# EAGLE design EMMITER (EAGLE 7.5.0)
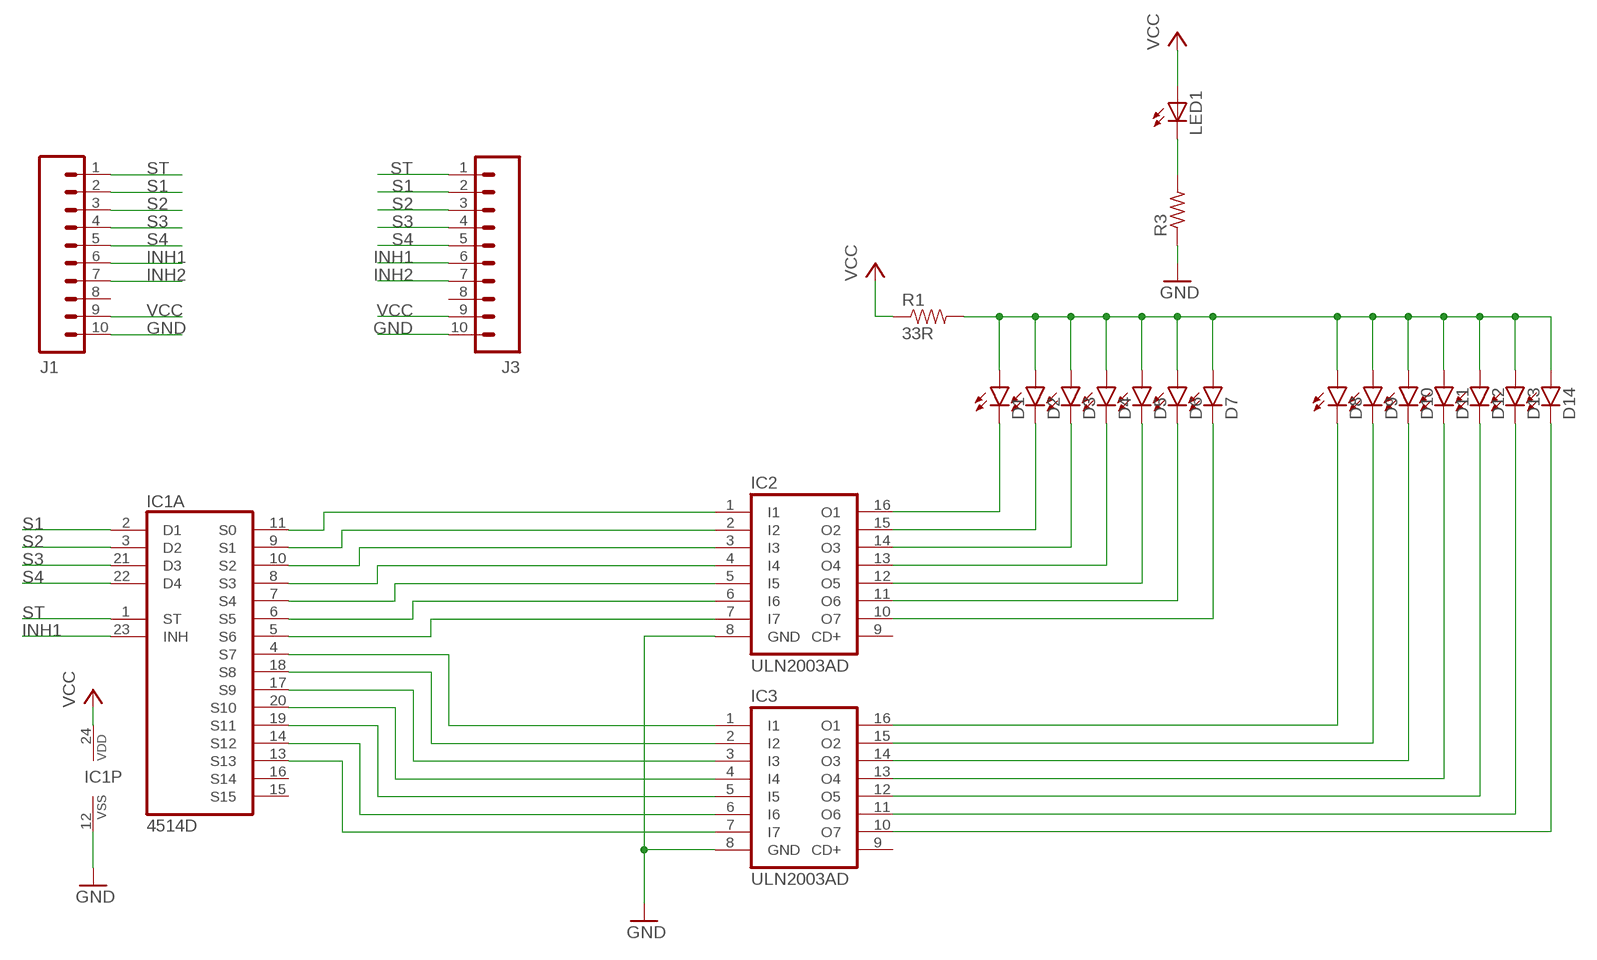
[diagram p0: schematic, sheet 1, part 1 of 2]
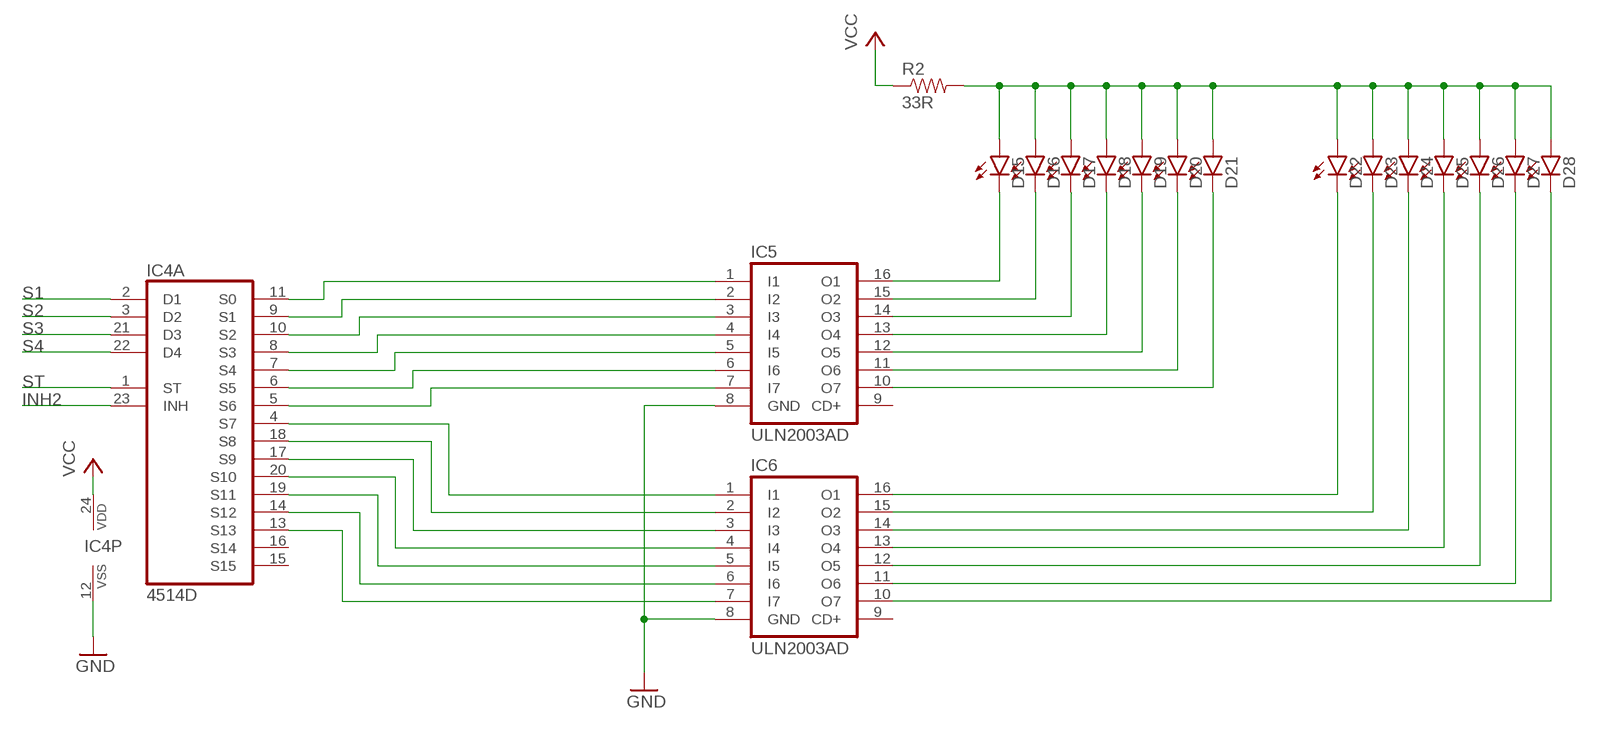
[diagram p1: schematic, sheet 1, part 2 of 2]

## Parts
D1  LED5MM  [LED5MM]
D2  LED5MM  [LED5MM]
D3  LED5MM  [LED5MM]
D4  LED5MM  [LED5MM]
D5  LED5MM  [LED5MM]
D6  LED5MM  [LED5MM]
D7  LED5MM  [LED5MM]
D8  LED5MM  [LED5MM]
D9  LED5MM  [LED5MM]
D10  LED5MM  [LED5MM]
D11  LED5MM  [LED5MM]
D12  LED5MM  [LED5MM]
D13  LED5MM  [LED5MM]
D14  LED5MM  [LED5MM]
D15  LED5MM  [LED5MM]
D16  LED5MM  [LED5MM]
D17  LED5MM  [LED5MM]
D18  LED5MM  [LED5MM]
D19  LED5MM  [LED5MM]
D20  LED5MM  [LED5MM]
D21  LED5MM  [LED5MM]
D22  LED5MM  [LED5MM]
D23  LED5MM  [LED5MM]
D24  LED5MM  [LED5MM]
D25  LED5MM  [LED5MM]
D26  LED5MM  [LED5MM]
D27  LED5MM  [LED5MM]
D28  LED5MM  [LED5MM]
IC1  4514D  [SO24W]
IC2  ULN2003AD  [SO16]
IC3  ULN2003AD  [SO16]
IC4  4514D  [SO24W]
IC5  ULN2003AD  [SO16]
IC6  ULN2003AD  [SO16]
J1  M10LOCK  [1X10_LOCK]
J3  M10LOCK  [1X10_LOCK]
LED1  LEDSMT1206  [1206]
R1  33R  RESISTORPTH-2W  [AXIAL-0.8]
R2  33R  RESISTORPTH-2W  [AXIAL-0.8]
R3  R-US_M1206  [M1206]

## Nets
GND: IC1.12(P:VSS) IC2.8(GND) IC3.8(GND) IC4.12(P:VSS) IC5.8(GND) IC6.8(GND) J1.10 J3.10 R3.1
INH1: IC1.23(A:INH) J1.6 J3.6
INH2: IC4.23(A:INH) J1.7 J3.7
N$1: IC1.11(A:S0) IC2.1(I1)
N$2: IC1.9(A:S1) IC2.2(I2)
N$3: IC1.10(A:S2) IC2.3(I3)
N$4: IC1.8(A:S3) IC2.4(I4)
N$5: IC1.7(A:S4) IC2.5(I5)
N$6: IC1.6(A:S5) IC2.6(I6)
N$7: IC1.5(A:S6) IC2.7(I7)
N$8: IC1.4(A:S7) IC3.1(I1)
N$9: IC1.18(A:S8) IC3.2(I2)
N$10: IC1.17(A:S9) IC3.3(I3)
N$11: IC1.20(A:S10) IC3.4(I4)
N$12: IC1.19(A:S11) IC3.5(I5)
N$13: IC1.14(A:S12) IC3.6(I6)
N$14: IC1.13(A:S13) IC3.7(I7)
N$15: D1.K(C) IC2.16(O1)
N$16: D2.K(C) IC2.15(O2)
N$17: D3.K(C) IC2.14(O3)
N$18: D4.K(C) IC2.13(O4)
N$19: D5.K(C) IC2.12(O5)
N$20: D6.K(C) IC2.11(O6)
N$21: D7.K(C) IC2.10(O7)
N$22: D8.K(C) IC3.16(O1)
N$23: D9.K(C) IC3.15(O2)
N$24: D10.K(C) IC3.14(O3)
N$25: D11.K(C) IC3.13(O4)
N$26: D12.K(C) IC3.12(O5)
N$27: D13.K(C) IC3.11(O6)
N$28: D14.K(C) IC3.10(O7)
N$29: IC4.11(A:S0) IC5.1(I1)
N$30: D1.A D2.A D3.A D4.A D5.A D6.A D7.A D8.A D9.A D10.A D11.A D12.A D13.A D14.A R1.P$2
N$31: IC4.9(A:S1) IC5.2(I2)
N$32: IC4.10(A:S2) IC5.3(I3)
N$33: IC4.8(A:S3) IC5.4(I4)
N$34: IC4.7(A:S4) IC5.5(I5)
N$35: IC4.6(A:S5) IC5.6(I6)
N$36: IC4.5(A:S6) IC5.7(I7)
N$37: IC4.4(A:S7) IC6.1(I1)
N$38: IC4.18(A:S8) IC6.2(I2)
N$39: IC4.17(A:S9) IC6.3(I3)
N$40: IC4.20(A:S10) IC6.4(I4)
N$41: IC4.19(A:S11) IC6.5(I5)
N$42: IC4.14(A:S12) IC6.6(I6)
N$43: IC4.13(A:S13) IC6.7(I7)
N$44: D15.K(C) IC5.16(O1)
N$45: D16.K(C) IC5.15(O2)
N$46: D17.K(C) IC5.14(O3)
N$47: D18.K(C) IC5.13(O4)
N$48: D19.K(C) IC5.12(O5)
N$49: D20.K(C) IC5.11(O6)
N$50: D21.K(C) IC5.10(O7)
N$51: D22.K(C) IC6.16(O1)
N$52: D23.K(C) IC6.15(O2)
N$53: D24.K(C) IC6.14(O3)
N$54: D25.K(C) IC6.13(O4)
N$55: D26.K(C) IC6.12(O5)
N$56: D27.K(C) IC6.11(O6)
N$57: D28.K(C) IC6.10(O7)
N$58: D15.A D16.A D17.A D18.A D19.A D20.A D21.A D22.A D23.A D24.A D25.A D26.A D27.A D28.A R2.P$2
N$60: LED1.C R3.2
S1: IC1.2(A:D1) IC4.2(A:D1) J1.2 J3.2
S2: IC1.3(A:D2) IC4.3(A:D2) J1.3 J3.3
S3: IC1.21(A:D3) IC4.21(A:D3) J1.4 J3.4
S4: IC1.22(A:D4) IC4.22(A:D4) J1.5 J3.5
ST: IC1.1(A:ST) IC4.1(A:ST) J1.1 J3.1
VCC: IC1.24(P:VDD) IC4.24(P:VDD) J1.9 J3.9 LED1.A R1.P$1 R2.P$1
Unconnected: IC1.15(A:S15) IC1.16(A:S14) IC2.9(CD+) IC3.9(CD+) IC4.15(A:S15) IC4.16(A:S14) IC5.9(CD+) IC6.9(CD+) J1.8 J3.8

## Library data of the parts
D1-D28 = SparkFun-LED:LED: LEDs Standard schematic elements and footprints for 5mm, 3mm, 1206, and 0603 sized LEDs. 5mm - Spark Fun Electronics SKU : COM-00529 (and others)
IC1 IC4 = 45xx:4514: 4-bit latch 4-16 line DECODER
IC2 IC3 IC5 IC6 = uln-udn:ULN2003A: DRIVER ARRAY
J1 J3 = SparkFun-Connectors:M10: Header 10 Standard 10-pin 0.1" header. Use with straight break away headers (SKU : PRT-00116), right angle break away headers (PRT-00553), swiss pins (PRT-00743), machine pins (PRT-00117), and female headers (PRT-00115).
LED1 = led:LED: LED OSRAM: - CHIPLED LG R971, LG N971, LY N971, LG Q971, LY Q971, LO R971, LY R971 LH N974, LH R974 LS Q976, LO Q976, LY Q976 LO Q996 - Hyper CHIPLED LW Q18S LB Q993, LB Q99A, LB R99A - SideLED LS A670, LO A670, LY A670, LG A670, LP A670 LB A673, LV A673, LT A673, LW A673 LH A674 LY A675 LS A676, LA A676, LO A676, LY A676, LW A676 LS A679, LY A679, LG A679 - Hyper Micro SIDELED® LS Y876, LA Y876, LO Y876, LY Y876 LT Y87S - SmartLED LW L88C, LW L88S LB L89C, LB L89S, LG L890 LS L89K, LO L89K, LY L89K LS L896, LA L896, LO L896, LY L896 - TOPLED LS T670, LO T670, LY T670, LG T670, LP T670 LSG T670, LSP T670, LSY T670, LOP T670, LYG T670 LG T671, LOG T671, LSG T671 LB T673, LV T673, LT T673, LW T673 LH T674 LS T676, LA T676, LO T676, LY T676, LB T676, LH T676, LSB T676, LW T676 LB T67C, LV T67C, LT T67C, LS T67K, LO T67K, LY T67K, LW E67C LS E67B, LA E67B, LO E67B, LY E67B, LB E67C, LV E67C, LT E67C LW T67C LS T679, LY T679, LG T679 LS T770, LO T770, LY T770, LG T770, LP T770 LB T773, LV T773, LT T773, LW T773 LH T774 LS E675, LA E675, LY E675, LS T675 LS T776, LA T776, LO T776, LY T776, LB T776 LHGB T686 LT T68C, LB T68C - Hyper Mini TOPLED® LB M676 - Mini TOPLED Santana® LG M470 LS M47K, LO M47K, LY M47K Source: http://www.osram.convergy.de LUXEON: - LUMILED® LXK2-PW12-R00, LXK2-PW12-S00, LXK2-PW14-U00, LXK2-PW14-V00 LXK2-PM12-R00, LXK2-PM12-S00, LXK2-PM14-U00 LXK2-PE12-Q00, LXK2-PE12-R00, LXK2-PE12-S00, LXK2-PE14-T00, LXK2-PE14-U00 LXK2-PB12-K00, LXK2-PB12-L00, LXK2-PB12-M00, LXK2-PB14-N00, LXK2-PB14-P00, LXK2-PB14-Q00 LXK2-PR12-L00, LXK2-PR12-M00, LXK2-PR14-Q00, LXK2-PR14-R00 LXK2-PD12-Q00, LXK2-PD12-R00, LXK2-PD12-S00 LXK2-PH12-R00, LXK2-PH12-S00 LXK2-PL12-P00, LXK2-PL12-Q00, LXK2-PL12-R00 Source: www.luxeon.com KINGBRIGHT: KA-3528ASYC Source: www.kingbright.com
R1 R2 = SparkFun-Resistors:RESISTOR: Resistor Basic schematic elements and footprints for 0603, 1206, and PTH resistors.
R3 = rcl:R-US_: RESISTOR, American symbol

## Board
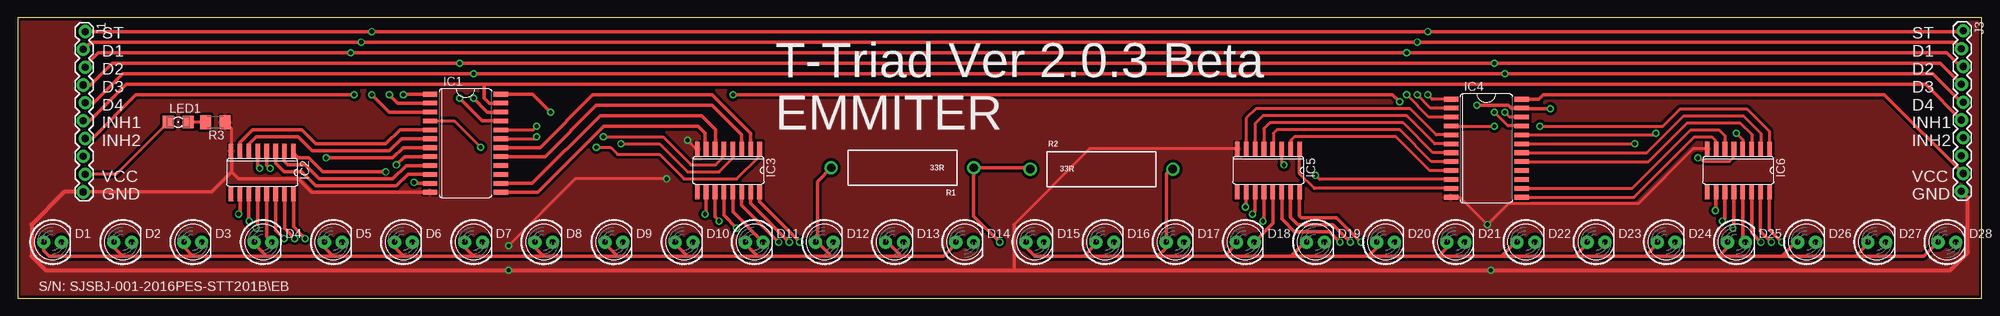
[diagram p2: board, top side]
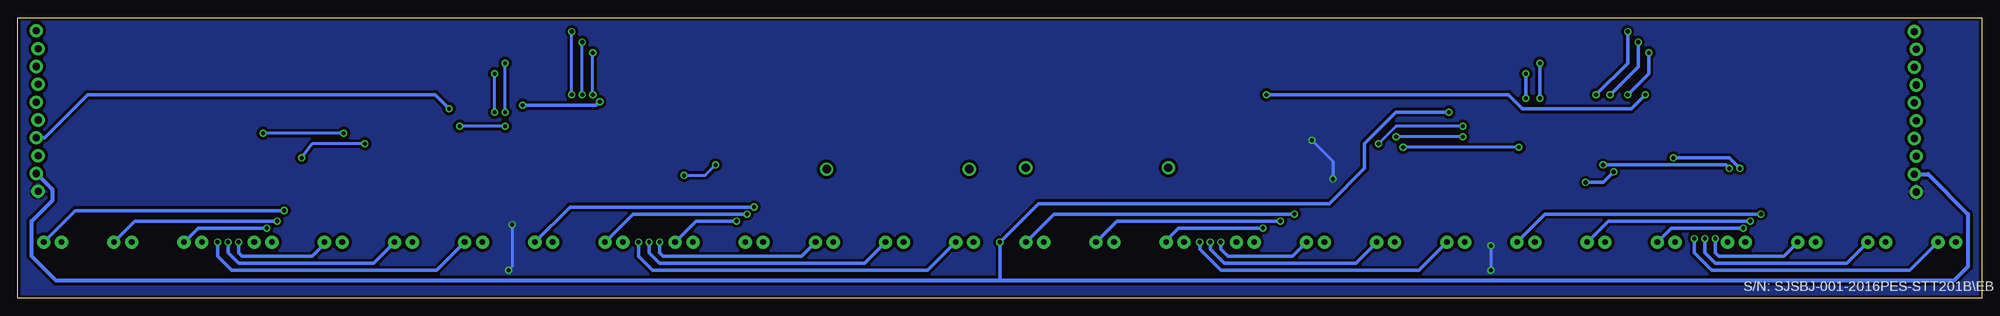
[diagram p3: board, bottom side, seen from below]

Size 280 x 40 mm. Coordinates in mm from the lower left corner, seen from the top.
Outline: 0,0 280,0 280,40 0,40 0,0
Copper layers (1*16): Top 0.035mm / dielectric 1.5mm / Bottom 0.035mm
Design rules "default *": minimum track width 5mil, minimum drill 15mil, track to track 7mil, track to pad 7mil, pad to pad 7mil, via to via 7mil, smd to smd 6mil, copper to edge 15mil, drill to drill 8mil, minimum pad ring 10mil, minimum via ring 8mil, stop-mask expansion 4mil, vias tented up to drill 0mil, thermal gap 10mil

### Footprints (pad centres in the part's own frame; a part is rotated, then mirrored left to right if it is on the bottom)
LED5MM = drill 0.813 pad 1.88: A -1.27,0; K 1.27,0
SO24W = smd 0.66 x 2.032: 1 -6.985,-5.029; 2 -5.715,-5.029; 3 -4.445,-5.029; 4 -3.175,-5.029; 5 -1.905,-5.029; 6 -0.635,-5.029; 7 0.635,-5.029; 8 1.905,-5.029; 9 3.175,-5.029; 10 4.445,-5.029; 11 5.715,-5.029; 12 6.985,-5.029; 13 6.985,5.029; 14 5.715,5.029; 15 4.445,5.029; 16 3.175,5.029; 17 1.905,5.029; 18 0.635,5.029; 19 -0.635,5.029; 20 -1.905,5.029; 21 -3.175,5.029; 22 -4.445,5.029; 23 -5.715,5.029; 24 -6.985,5.029
SO16 = smd 0.66 x 2.032: 1 -4.445,-3.073; 2 -3.175,-3.073; 3 -1.905,-3.073; 4 -0.635,-3.073; 5 0.635,-3.073; 6 1.905,-3.073; 7 3.175,-3.073; 8 4.445,-3.073; 9 4.445,3.073; 10 3.175,3.073; 11 1.905,3.073; 12 0.635,3.073; 13 -0.635,3.073; 14 -1.905,3.073; 15 -3.175,3.073; 16 -4.445,3.073
1X10_LOCK = drill 1.016 pad 1.88: 1 0,0.127; 2 2.54,-0.127; 3 5.08,0.127; 4 7.62,-0.127; 5 10.16,0.127; 6 12.7,-0.127; 7 15.24,0.127; 8 17.78,-0.127; 9 20.32,0.127; 10 22.86,-0.127
1206 = smd 1.6 x 1.803: A -1.422,0; C 1.422,0
AXIAL-0.8 = drill 1.2 pad 1.88: P$1 -10.16,0; P$2 10.16,0
M1206 = smd 1.6 x 2: 1 -1.4,0; 2 1.4,0

### Placement (x,y rotation side)
D1  5,8 0 top
D2  15,8 0 top
D3  25,8 0 top
D4  35,8 0 top
D5  45,8 0 top
D6  55,8 0 top
D7  65,8 0 top
D8  75,8 0 top
D9  85,8 0 top
D10  95,8 0 top
D11  105,8 0 top
D12  115,8 0 top
D13  125,8 0 top
D14  135,8 0 top
D15  145,8 0 top
D16  155,8 0 top
D17  165,8 0 top
D18  175,8 0 top
D19  185,8 0 top
D20  195,8 0 top
D21  205,8 0 top
D22  215,8 0 top
D23  225,8 0 top
D24  235,8 0 top
D25  245,8 0 top
D26  255,8 0 top
D27  265,8 0 top
D28  275,8 0 top
IC1  63.85,22.09 270 top
IC2  34.88,17.92 180 top
IC3  101.32,18.22 180 top
IC4  209.35,21.37 270 top
IC5  178.29,18.22 180 top
IC6  245.26,18.22 180 top
J1  9.5,38 270 top
J3  277.2,38.1 270 top
LED1  22.9,25.1 0 top
R1  126.13,18.6 180 top
R2  154.51,18.4 0 top
R3  28.2,25.1 180 top

### Tracks (layer width: path | path; a pad name or v marks a point on that pad's centre or on a via)
GND  (via drill 0.6)
  Top 0.406: IC3.8 96.71,21.29 v95.5,22.5 | v92.5,17 79.5,17 v70,7.5 | IC5.8 152.79,21.29 142,10.5 142,4 | IC4.12 205.62,14.39 v209.5,10.5 212.5,13.5 231,13.5 238.79,21.29 IC6.8 | R3.1 30.43,24.27 IC2.8
  Top 0.5: IC1.12 41.9,15.11 40,17 31.5,17 30.5,18 | 30.5,18 30.5,20.93 IC2.8 | J1.10 27.64,15.14 30.5,18
  Top 0.6: J1.10 6.64,15.14 2,10.5 2,6 4,4 v70,4 142,4 v210,4 275.5,4 278,6.5 278,14.31 J3.10
  Bottom 0.406: v95.5,22.5 92.5,19.5 v92.5,17 | v70,7.5 v70,4 | v209.5,10.5 209.5,4.5 v210,4
  pour Top (isolate 0.406): 0,40 280,40 280,0 0,0
  pour Bottom (isolate 0.406): 0,40 280,40 280,1 280,0 0,0
INH1
  Top 0.5: 9.37,25.37 J1.6 10.3,25.3 15.5,30.5 66.5,30.5 | 66.5,30.5 271.97,30.5 J3.6 | IC1.23 67.19,27.8 66.5,28.5 66.5,30.5
INH2  (via drill 0.6)
  Top 0.5: v208,27.5 212.5,27.5 212.91,27.09 IC4.23 214.46,27 v218.5,27 | v197,28 196,29 v102,29 | v48,29 16.87,29 10.63,22.76 J1.7
  Bottom 0.5: v208,27.5 197.5,27.5 v197,28 | v102,29 67.5,29 65.5,27 50,27 v48,29 | J3.7 276.14,22.86 270,29 220.5,29 v218.5,27
N$1  (via drill 0.6)
  Top 0.5: IC1.11 56.62,16.38 v56.5,16.5 | v52.5,18 43.5,18 41.5,20 40,20 39.33,20.68 IC2.1
  Bottom 0.5: v56.5,16.5 54,16.5 v52.5,18
N$2
  Top 0.5: IC1.9 55.41,18.91 53.5,17 43,17 41,19 38.5,19 38,19.5 38,20.94 IC2.2
N$3
  Top 0.5: IC1.10 55.65,17.64 54,16 42.5,16 40.5,18 38,18 36.78,19.21 IC2.3
N$4  (via drill 0.6)
  Top 0.5: IC1.8 55.19,20.18 v54,19 | v36,18.5 35.52,18.98 IC2.4
  Bottom 0.5: v54,19 36.5,19 v36,18.5
N$5  (via drill 0.6)
  Top 0.5: IC1.7 54.95,21.45 53.5,20 v44,20 | v34.5,18.5 34.24,18.75 IC2.5
  Bottom 0.5: v44,20 36,20 v34.5,18.5
N$6
  Top 0.5: IC1.6 54.73,22.73 53,21 42,21 40,23 34,23 33,22 33,21.02 IC2.6
N$7
  Top 0.5: IC2.7 31.7,22.2 33.5,24 40.5,24 42.5,22 52.5,22 54.5,24 IC1.5
N$8  (via drill 0.6)
  Top 0.406: IC1.4 62.23,25.27 v66,21.5 | v82.5,21.5 84.5,21.5 85.5,20.5 91.5,20.5 95,17 102.5,17 105.77,20.27 IC3.1
  Bottom 0.406: v66,21.5 v82.5,21.5
N$9
  Top 0.5: IC1.18 74.45,21.45 82,29 99,29 104.5,23.5 IC3.2
N$10
  Top 0.5: IC1.17 75.19,20.18 82.5,27.5 99,27.5 103.22,23.27 IC3.3
N$11  (via drill 0.6)
  Top 0.406: IC1.20 73.5,24 v74,24.5 | v86,22 91.5,22 95.5,18 100,18 102,20 102,21.25 IC3.4
  Bottom 0.406: v74,24.5 83.5,24.5 v86,22
N$12  (via drill 0.6)
  Top 0.406: IC1.19 73.72,22.73 v74,23 | v83.5,23 92,23 96,19 99.5,19 100.5,20 100.5,21.11 IC3.5
  Bottom 0.406: v74,23 v83.5,23
N$13
  Top 0.5: IC1.14 73.38,16.38 83,26 97.5,26 99.5,24 99.5,21.38 IC3.6
N$14
  Top 0.5: IC1.13 74.11,15.11 83.5,24.5 97,24.5 98,23.5 98,21.44 IC3.7
N$15  (via drill 0.6)
  Top 0.5: IC2.16 39.33,10.18 v41,8.5
  Bottom 0.5: v41,8.5 41,6.5 38.5,4 10.27,4 D1.K
N$16  (via drill 0.6)
  Top 0.5: IC2.15 38.05,9.95 v39.5,8.5
  Bottom 0.5: v39.5,8.5 39.5,6.5 38,5 19.27,5 D2.K
N$17  (via drill 0.6)
  Top 0.5: IC2.14 36.78,9.71 v38,8.5
  Bottom 0.5: v38,8.5 38,6.5 37.5,6 28.27,6 D3.K
N$18
  Top 0.5: IC2.13 35.52,8.76 D4.K
N$19  (via drill 0.6)
  Top 0.5: IC2.12 34.24,10.24 v34,10
  Bottom 0.5: v34,10 44.27,10 D5.K
N$20  (via drill 0.6)
  Top 0.5: IC2.11 32.98,11.03 v33,11
  Bottom 0.5: v33,11 53.27,11 D6.K
N$21  (via drill 0.6)
  Top 0.5: IC2.10 31.7,12.21 v31.5,12
  Bottom 0.5: v31.5,12 62.27,12 D7.K
N$22  (via drill 0.6)
  Top 0.5: IC3.16 105.77,13.73 v111.5,8
  Bottom 0.5: v111.5,8 111.5,7 108.5,4 80.27,4 D8.K
N$23  (via drill 0.6)
  Top 0.5: IC3.15 104.5,13.51 v110,8
  Bottom 0.5: v110,8 110,7 108,5 89.27,5 D9.K
N$24  (via drill 0.6)
  Top 0.5: IC3.14 103.22,13.28 v108.5,8
  Bottom 0.5: v108.5,8 108.5,7 107.5,6 98.27,6 D10.K
N$25
  Top 0.5: IC3.13 101.95,12.31 D11.K
N$26  (via drill 0.6)
  Top 0.5: IC3.12 100.69,11.81 v102.5,10
  Bottom 0.5: v102.5,10 114.5,10 116,8.5 116,8.27 D12.K
N$27  (via drill 0.6)
  Top 0.5: IC3.11 99.42,11.59 v100,11
  Bottom 0.5: v100,11 123.27,11 D13.K
N$28  (via drill 0.6)
  Top 0.5: IC3.10 98.14,12.14 v98,12
  Bottom 0.5: v98,12 132.27,12 D14.K
N$29
  Top 0.406: IC4.11 184.84,15.66 182.74,17.77 IC5.1
N$30
  Top 0.5: D1.A 3.73,6.77 4.5,6 15,6 | 15,6 25,6 | 25,6 35.5,6 | 35.5,6 45,6 | 45,6 55,6 | 55,6 65,6 | 65,6 75,6 | 75,6 85.5,6 | 85.5,6 95.5,6 | 95.5,6 105.5,6 | 105.5,6 116,6 | 116,6 126,6 | 126,6 132,6 133.5,7.5 133.5,7.77 D14.A | D13.A 124,8 126,6 | D12.A 114,8 | 114,8 116,6 | D11.A 103.73,7.77 105.5,6 | D10.A 93.73,7.77 95.5,6 | D9.A 83.73,7.77 85.5,6 | D8.A 73.73,7.27 75,6 | D7.A 63.73,7.27 65,6 | D6.A 53.73,7.27 55,6 | D5.A 43.73,7.27 45,6 | D4.A 33.73,7.77 35.5,6 | D3.A 23.73,7.27 25,6 | D2.A 13.73,7.27 15,6 | 114,8 114,16.63 R1.P$2
N$31
  Top 0.406: IC4.9 201.31,18.2 196.5,23 182,23 181.5,22.5 181.5,21.33 IC5.2
N$32  (via drill 0.6)
  Top 0.406: IC4.10 185.57,16.93 v185,17.5 | v180.5,19 180.19,19.3 IC5.3
  Bottom 0.406: v185,17.5 182,17.5 v180.5,19
N$33
  Top 0.406: IC4.8 201.53,19.46 197,24 179.5,24 179,23.5 179,21.37 IC5.4
N$34
  Top 0.406: IC4.7 201.76,20.73 197.5,25 178.5,25 177.66,24.16 IC5.5
N$35
  Top 0.406: IC4.6 202,22 198,26 177.5,26 176.38,24.89 IC5.6
N$36
  Top 0.406: IC4.5 202.22,23.27 198.5,27 176.5,27 175.12,25.61 IC5.7
N$37  (via drill 0.6)
  Top 0.406: IC4.4 204.37,24.5 v210.5,24.5 | v217,24.5 234.5,24.5 237,27 246.5,27 249.71,23.8 IC6.1
  Bottom 0.406: v210.5,24.5 v217,24.5
N$38
  Top 0.406: IC4.18 232.24,20.73 237.5,26 246,26 248.5,23.5 248.5,21.23 | 248.5,20.5 248.5,21.23 | 248.5,21.23 IC6.2
N$39
  Top 0.406: IC4.17 232.47,19.46 238,25 245.5,25 247.16,23.34 IC6.3
N$40  (via drill 0.6)
  Top 0.406: IC4.20 233.28,23.27 v233.5,23.5 | v245,23.5 245.9,22.61 IC6.4
  Bottom 0.406: v233.5,23.5 v245,23.5
N$41  (via drill 0.6)
  Top 0.406: IC4.19 v230.5,22 | v239.5,20 240.5,19.5 244,19.5 244.62,20.12 IC6.5
  Bottom 0.406: v230.5,22 238,22 v239.5,20
N$42
  Top 0.406: IC4.14 230.16,15.66 238.5,24 242.5,24 243.35,23.14 IC6.6
N$43
  Top 0.406: IC4.13 230.38,14.39 239,23 241.5,23 242,22.5 242,21.38 IC6.7
N$44  (via drill 0.6)
  Top 0.5: IC5.16 182.74,11.77 183,11.5 188,11.5 v191.5,8
  Bottom 0.5: v191.5,8 191.5,6 189.5,4 150.27,4 D15.K
N$45  (via drill 0.6)
  Top 0.5: IC5.15 181.47,11.54 182.5,10.5 187.5,10.5 v190,8
  Bottom 0.5: v190,8 190,6.5 188.5,5 159.27,5 D16.K
N$46  (via drill 0.6)
  Top 0.5: IC5.14 180.19,11.3 182,9.5 187,9.5 v188.5,8
  Bottom 0.5: v188.5,8 188.5,6.5 188,6 168.27,6 D17.K
N$47
  Top 0.5: IC5.13 178.93,10.65 D18.K
N$48  (via drill 0.6)
  Top 0.5: IC5.12 177.66,11.15 v177.5,11
  Bottom 0.5: v177.5,11 183.27,11 D19.K
N$49  (via drill 0.6)
  Top 0.5: IC5.11 176.38,12.38 v176,12
  Bottom 0.5: v176,12 192.27,12 D20.K
N$50  (via drill 0.6)
  Top 0.5: IC5.10 175.12,13.12 v175,13
  Bottom 0.5: v175,13 201.27,13 D21.K
N$51  (via drill 0.6)
  Top 0.5: IC6.16 249.71,9.79 v251.5,8
  Bottom 0.5: v251.5,8 251.5,6 249.5,4 220.27,4 D22.K
N$52  (via drill 0.6)
  Top 0.5: IC6.15 248.44,9.56 v250,8
  Bottom 0.5: v250,8 250,6.5 248.5,5 229.27,5 D23.K
N$53  (via drill 0.6)
  Top 0.5: IC6.14 247.16,9.34 v248.5,8
  Bottom 0.5: v248.5,8 248.5,6.5 248,6 238,6 236.5,7.5 236.5,7.77 D24.K
N$54
  Top 0.5: IC6.13 245.9,8.38 D25.K
N$55  (via drill 0.6)
  Top 0.5: IC6.12 244.62,10.12 v244.5,10
  Bottom 0.5: v244.5,10 254.27,10 D26.K
N$56  (via drill 0.6)
  Top 0.5: IC6.11 243.35,11.36 v243,11
  Bottom 0.5: v243,11 263.27,11 D27.K
N$57  (via drill 0.6)
  Top 0.5: IC6.10 242.09,12.59 v242,12.5
  Bottom 0.5: v242,12.5 271.77,12.5 D28.K
N$58
  Top 0.5: D15.A 143.73,7.27 145,6 152,6 | 152,6 162.5,6 | 162.5,6 172,6 | 172,6 181.5,6 | 181.5,6 192.5,6 | 192.5,6 202.5,6 | 202.5,6 211.5,6 | 211.5,6 222,6 | 222,6 232,6 | 232,6 242.5,6 | 242.5,6 251.5,6 | 251.5,6 262,6 | 262,6 271.73,6 D28.A | D27.A 263.73,7.73 262,6 | D26.A 253.5,8 251.5,6 | D25.A 243.73,7.23 242.5,6 | D24.A 233.73,7.73 232,6 | D23.A 223.73,7.73 222,6 | D22.A 213.5,8 211.5,6 | D21.A 203.73,7.23 202.5,6 | D20.A 193.73,7.23 192.5,6 | D19.A 183.5,8 181.5,6 | D18.A 173.73,7.73 172,6 | 162.5,6 163.73,7.23 D17.A 163.73,17.73 165,19 165,18.73 R2.P$2 | D16.A 153.73,7.73 152,6
N$60
  Top 0.406: R3.2 LED1.C
S1  (via drill 0.6)
  Top 0.127: 10.16,36.1 10.13,36.13
  Top 0.406: IC4.2 201.41,27.09 v199.5,29
  Top 0.5: J3.2 276.13,36.5 v199.5,36.5 v49,36.5 10.5,36.5 10.13,36.13 10.04,36.13 J1.2 | IC1.2 54.2,27.8 v53,29
  Bottom 0.406: v199.5,29 v199.5,36.5
  Bottom 0.5: v53,29 49,33 v49,36.5
S2  (via drill 0.6)
  Top 0.406: IC4.3 201.19,25.82 v198,29
  Top 0.5: J3.3 276.98,33.02 275,35 v198,35 v47.5,35 11.5,35 9.63,33.13 J1.3 | IC1.3 52.97,26.54 v50.5,29
  Bottom 0.406: v198,29 v198,35
  Bottom 0.5: v50.5,29 47.5,32 v47.5,35
S3  (via drill 0.6)
  Top 0.406: IC4.21 212.46,24.55 v210.5,26.5
  Top 0.5: J1.4 10.38,30.38 13.5,33.5 v63,33.5 v210.5,33.5 274.05,33.5 J3.4 | IC1.21 66.23,25.27 v63,28.5
  Bottom 0.406: v210.5,26.5 v210.5,33.5
  Bottom 0.5: v63,28.5 v63,33.5
S4  (via drill 0.6)
  Top 0.406: IC4.22 212.69,25.82 v212,26.5
  Top 0.5: 9.84,27.84 J1.5 10.84,27.84 15,32 v65,32 v212,32 273,32 277,28 277.27,28 J3.5 | IC1.22 66.97,26.54 v65,28.5
  Bottom 0.406: v212,26.5 v212,32
  Bottom 0.5: v65,28.5 v65,32
ST  (via drill 0.6)
  Top 0.406: IC4.1 201.65,28.36 v201,29
  Top 0.5: J1.1 v50.5,38 v201,38 277.23,38 J3.1 | IC1.1 55.08,29.07 v55,29
  Bottom 0.406: v201,29 v201,38
  Bottom 0.5: v55,29 50.5,33.5 v50.5,38
VCC  (via drill 0.6)
  Top 0.406: LED1.A 14.06,17.68 J1.9
  Top 0.5: R2.P$1 144.15,18.6 R1.P$1 136.29,11.71 v140,8 | IC4.24 216.85,28.36 217.5,29 266.11,29 J3.9 | IC1.24 73.42,29.07 v76,26.5
  Bottom 0.5: 140,2.5 v140,8 134.5,13.5 93,13.5 88,18.5 88,22 83.5,26.5 v76,26.5
  Bottom 0.6: J1.9 7.68,17.68 2,12 2,4.5 4,2.5 140,2.5 274.5,2.5 278,6 278,11 275,14 275,15.45 J3.9

### Text on the board
tNames: T-Triad Ver 2.0.3 Beta / EMMITER | ST / D1 / D2 / D3 / D4 / INH1 / INH2 / / VCC / GND | ST / D1 / D2 / D3 / D4 / INH1 / INH2 / / VCC / GND | S/N: SJSBJ-001-2016PES-STT201B\EB
bNames: S/N: SJSBJ-001-2016PES-STT201B\EB